# EAGLE design Sonar-Amplifier (EAGLE 8.7.0)
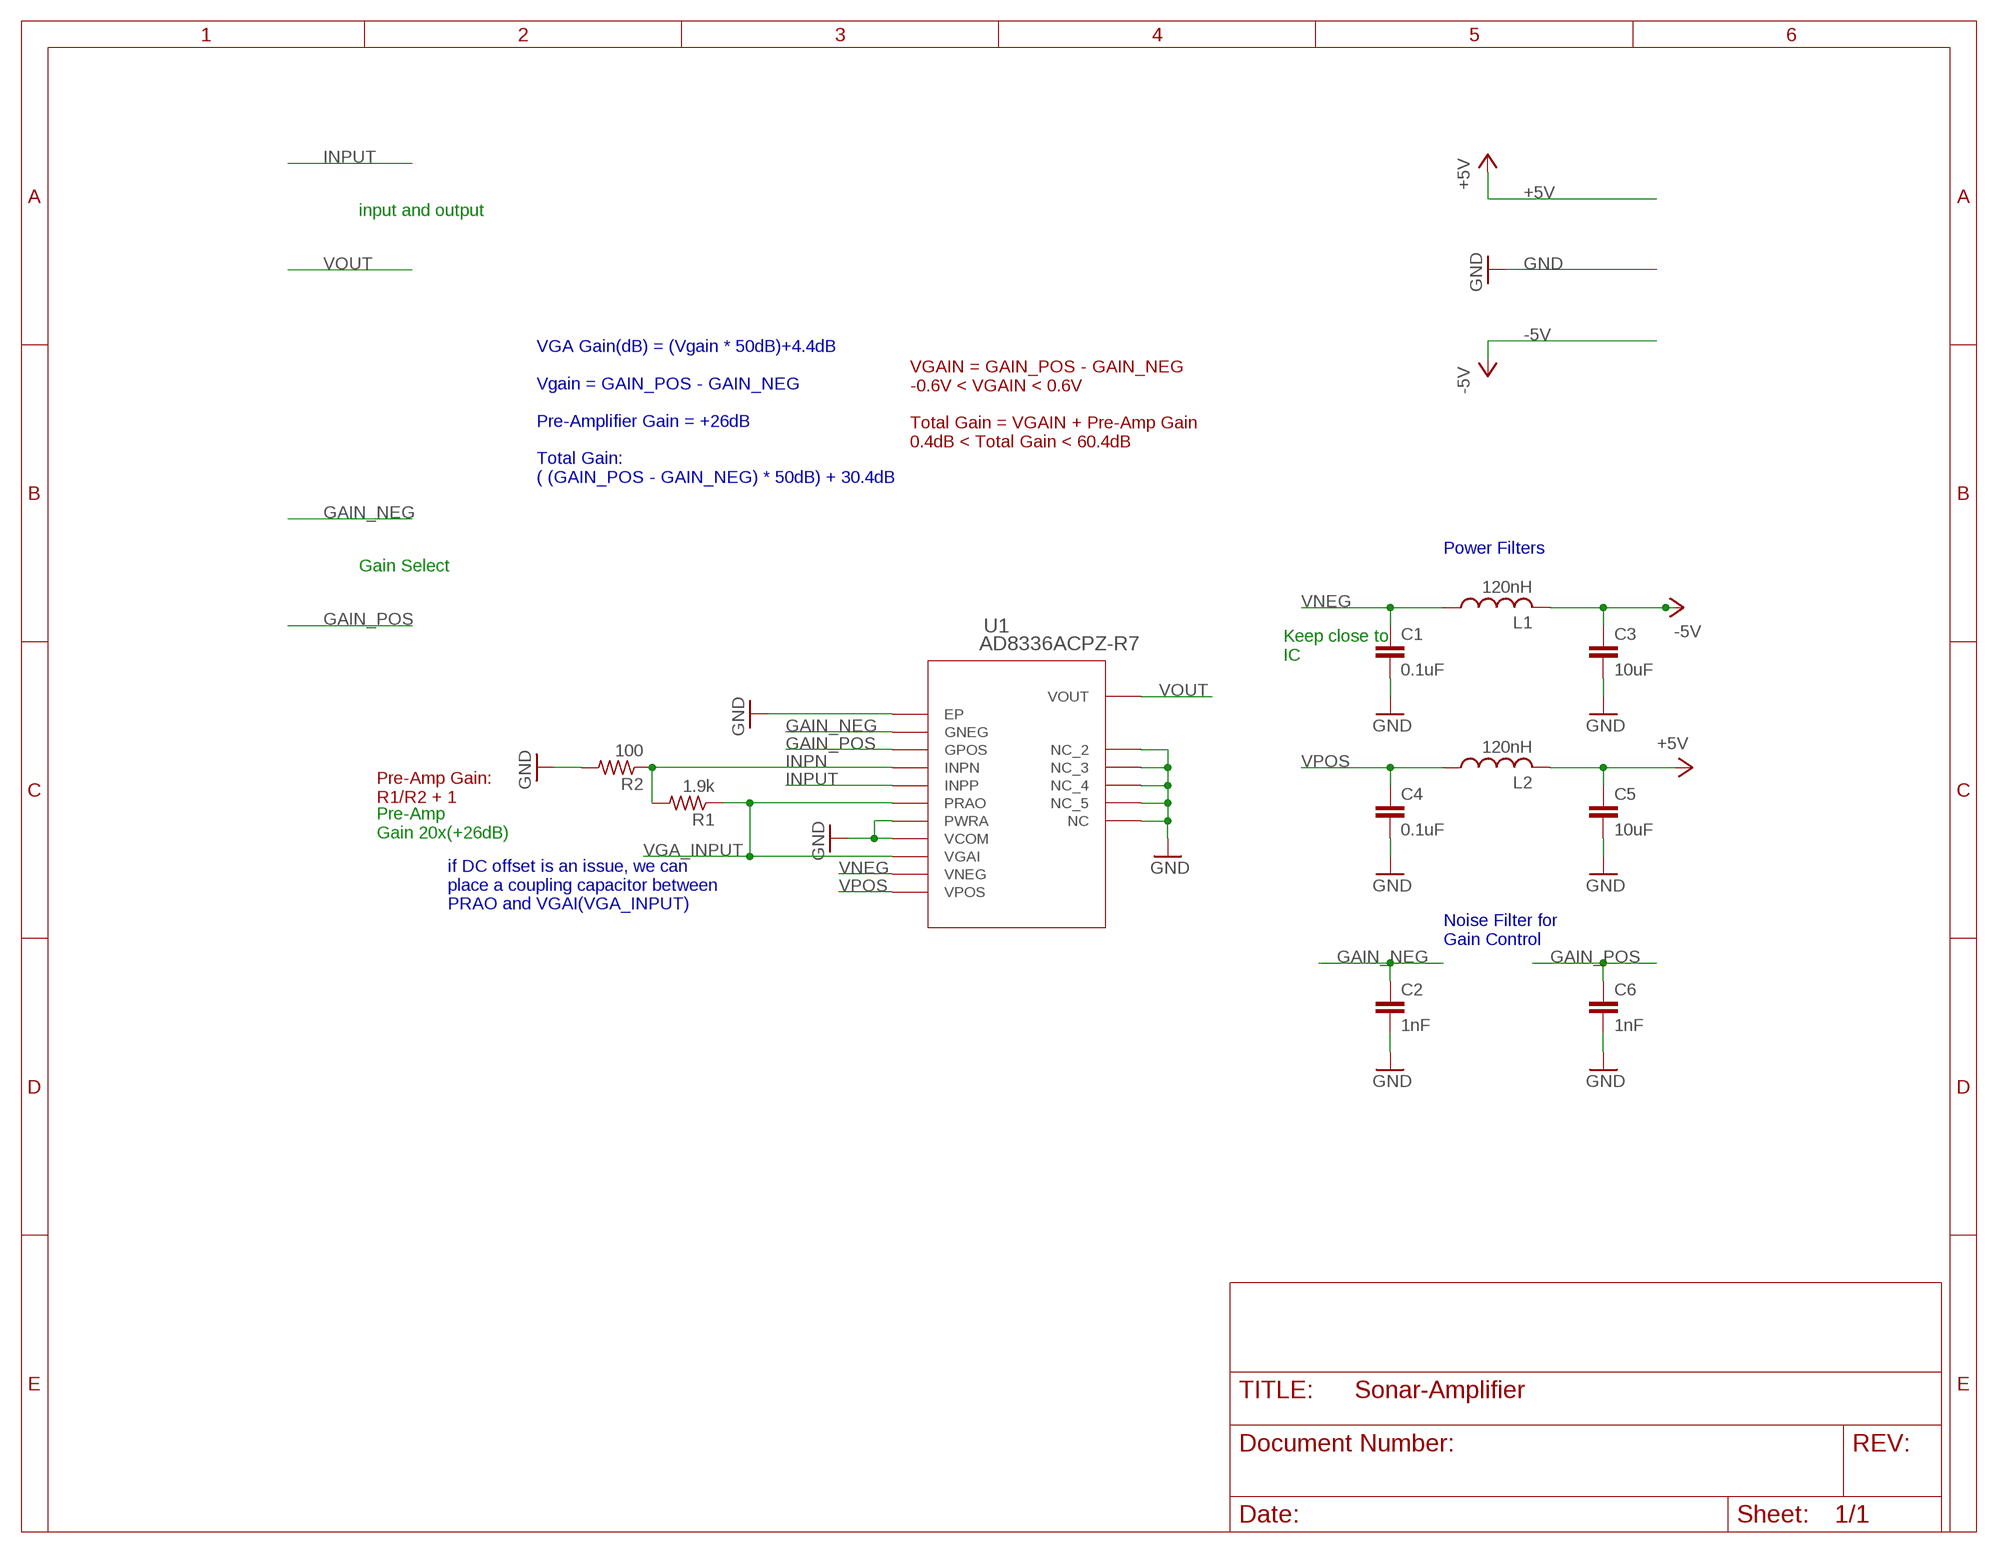
[diagram p0: schematic, sheet 1]

## Parts
C1  0.1uF  C-EUC0603  [C0603]
C2  1nF  C-EUC0603  [C0603]
C3  10uF  C-EUC1206  [C1206]
C4  0.1uF  C-EUC0603  [C0603]
C5  10uF  C-EUC1206  [C1206]
C6  1nF  C-EUC0603  [C0603]
L1  120nH  L-USL3225P  [L3225P]
L2  120nH  L-USL3225P  [L3225P]
R1  1.9k  R-US_R0603  [R0603]
R2  100  R-US_R0603  [R0603]
U1  AD8336ACPZ-R7  [CP_16_4]

## Nets
+5V: C5.1 L2.2
-5V: C3.1 L1.2
GAIN_NEG: C2.1 U1.GNEG
GAIN_POS: C6.1 U1.GPOS
GND: C1.2 C2.2 C3.2 C4.2 C5.2 C6.2 R2.2 U1.GND1(EP) U1.NC U1.NC1(NC_2) U1.NC2(NC_3) U1.NC3(NC_4) U1.NC4(NC_5) U1.PWRA U1.VCOM
INPN: R1.2 R2.1 U1.INPN
INPUT: U1.INPP
VGA_INPUT: R1.1 U1.PRAO U1.VGAI
VNEG: C1.1 L1.1 U1.VNEG
VOUT: U1.VOUT
VPOS: C4.1 L2.1 U1.VPOS

## Notes on the sheet
- input and output
- VGAIN = GAIN_POS - GAIN_NEG
  -0.6V < VGAIN < 0.6V
  
  Total Gain = VGAIN + Pre-Amp Gain
  0.4dB < Total Gain < 60.4dB
- VGA Gain(dB) = (Vgain * 50dB)+4.4dB
  
  Vgain = GAIN_POS - GAIN_NEG
  
  Pre-Amplifier Gain = +26dB
  
  Total Gain:
  ( (GAIN_POS - GAIN_NEG) * 50dB) + 30.4dB
- Power Filters
- Gain Select
- Keep close to 
  IC
- Pre-Amp Gain:
  R1/R2 + 1
- Pre-Amp 
  Gain 20x(+26dB)
- if DC offset is an issue, we can
  place a coupling capacitor between
  PRAO and VGAI(VGA_INPUT)
- Noise Filter for
  Gain Control

## Library data of the parts
C1 C2 C4 C6 = rcl:C-EU: CAPACITOR, European symbol; SPICEPREFIX: C
C3 C5 = resistor:C-EU: CAPACITOR, European symbol
L1 L2 = resistor:L-US: INDUCTOR, American symbol
R1 R2 = rcl:R-US_: RESISTOR, American symbol; SPICEPREFIX: R
U1 = Amplifier-Sonar-LBR:AD8336ACPZ-R7; MANUFACTURER_PART_NUMBER: AD8336ACPZR7; VENDOR: Analog Devices Inc

## Board
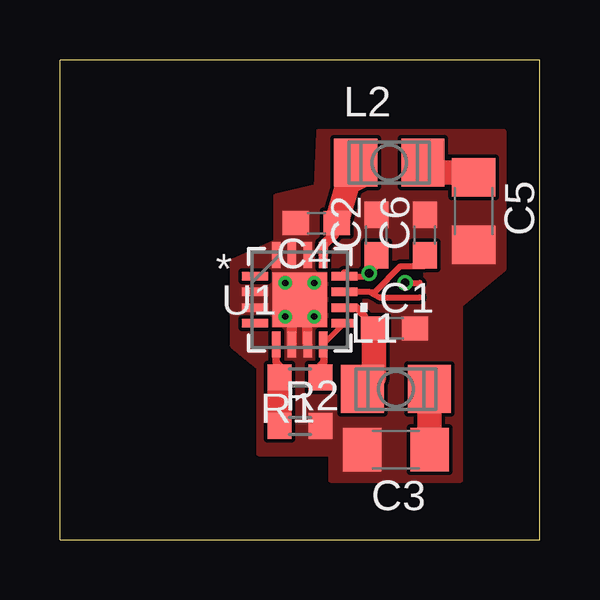
[diagram p1: board, top side]
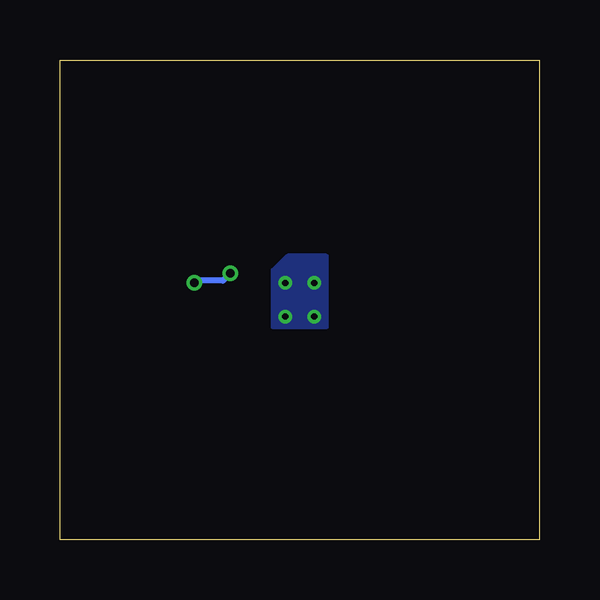
[diagram p2: board, bottom side, seen from below]

Size 20 x 20 mm. Coordinates in mm from the lower left corner, seen from the top.
Outline: 0,0 20,0 20,20 0,20 0,0
Copper layers (1*2*15*16): Top 0.035mm / dielectric 0.1702mm / Route2 0.0175mm / dielectric 47mil / Route15 0.0175mm / dielectric 0.1702mm / Bottom 0.035mm
Design rules "JLCPCB4Layer": minimum track width 6mil, minimum drill 10mil, track to track 6mil, track to pad 6mil, pad to pad 6mil, via to via 6mil, smd to smd 0mil, copper to edge 10mil, drill to drill 10mil, minimum pad ring 6mil, minimum via ring 6mil, stop-mask expansion 2mil, vias tented up to drill 100mil, thermal gap 10mil

### Footprints (pad centres in the part's own frame; a part is rotated, then mirrored left to right if it is on the bottom)
C0603 = smd 1.1 x 1: 1 -0.85,0; 2 0.85,0
C1206 = smd 1.6 x 1.8: 1 -1.4,0; 2 1.4,0
L3225P = smd 1.8 x 2: 1 -1.4,0; 2 1.4,0
R0603 = smd 1 x 1.1: 1 -0.85,0; 2 0.85,0
CP_16_4 = smd 2.261 x 2.261: GND1 0,0 | smd 1.067 x 0.356: GNEG 1.865,0.975; GPOS 1.865,0.325; INPP -1.865,-0.975; PWRA -1.865,0.325; VCOM -1.865,-0.325; VGAI 1.865,-0.975; VNEG 1.865,-0.325; VOUT -1.865,0.975 | smd 0.356 x 1.067: INPN -0.975,-1.865; NC 0.325,-1.865; NC1 -0.325,-1.865; NC2 0.325,1.865; NC3 -0.325,1.865; NC4 -0.975,1.865; PRAO 0.975,-1.865; VPOS 0.975,1.865

### Placement (x,y rotation side)
C1  13.95,8.81 0 top
C2  13.2,12.7 90 top
C3  14.01,3.75 180 top
C4  10.69,13.2 180 top
C5  17.25,13.7 270 top
C6  15.22,12.7 90 top
L1  14.01,6.28 0 top
L2  13.73,15.72 0 top
R1  10.01,6.76 180 top
R2  10.01,4.74 0 top
U1  10,10 0 top

### Tracks (layer width: path | path; a pad name or v marks a point on that pad's centre or on a via)
+5V
  Top 1.016: L2.2 15.52,15.3 17.02,15.3 C5.1
-5V
  Top 1.016: L1.2 C3.1
GAIN_NEG  (via drill 0.35)
  Top 0.254: v14.4,10.71 v14.41,10.7 15,10.7 | U1.GNEG 12.78,10.97 v12.9,11.1 13.17,11.37 C2.1
  Top 0.305: 11.87,11.12 U1.GNEG
  Bottom 0.254: v12.9,11.1 13.2,10.8 14.31,10.8 v14.4,10.71
GAIN_POS
  Top 0.254: 12.9,10.32 U1.GPOS | 12.9,10.32 13.33,10.1 15,10.1 | 12.9,10.32 13.12,10.32 14.2,11.4 15.18,11.4 C6.1
GND  (via drill 0.26)
  Top 0.152: 9.68,9.68 9.9,9.9 | 9.9,9.9 U1.GND1 | 10.32,9.68 10.05,9.95 | 10.05,9.95 U1.GND1 | 9.78,9.68 10.05,9.95 | 9.03,10.78 9.9,9.9 | 9.68,10.32 9.95,10.05 | 10.32,10.43 9.95,10.05 | 9.95,10.05 U1.GND1
  Top 0.305: 9.05,11.89 U1.NC4
  Top 0.406: U1.NC1 9.68,9.68 | U1.NC 10.32,9.68
  other vias: 9.4,10.7 10.6,10.7 10.6,9.3 9.4,9.3
  pour Bottom (no thermals): 8.9,8.9 8.9,11.8 10.5,11.8 11.1,11.2 11.1,8.9
  pour Top (no thermals): 18.5,11.3 18.5,17 10.8,17 10.7,14.7 9,14.3 9,12.4 7.2,11.6 7.2,8.1 8.3,7.2 8.3,3.6 11.3,3.6 11.3,2.5 16.7,2.5 16.7,9.8
INPN
  Top 0.305: R1.2 9.16,7.24 9,7.4 9,8.11 U1.INPN
  Top 1.016: R2.1 R1.2
VGA_INPUT
  Top 0.2: U1.VGAI U1.PRAO
  Top 0.305: R1.1 10.86,7.26 11,7.4 11,8.11 U1.PRAO
VNEG
  Top 0.305: C1.1 12.7,9.21 12.7,9.33 12.36,9.68 U1.VNEG
  Top 0.813: L1.1 13.1,6.77
  Top 1.016: 13.1,6.77 C1.1
VPOS
  Top 0.406: C4.1 11.45,12.75 10.97,12.28 U1.VPOS
  Top 1.016: C4.1 12,14.86 12.72,15.23 L2.1